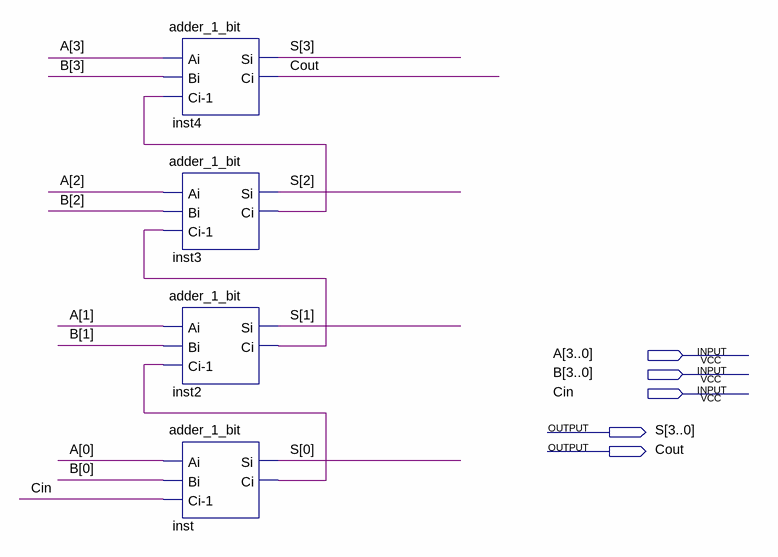
[diagram p0: schematic sheet]
// Quartus schematic adder_4_bits.bdf as structural Verilog: 4 symbols, 5 pins
module adder_4_bits (
  input  [3:0] A,
  input  [3:0] B,
  input  Cin,
  output [3:0] S,
  output Cout
);

  wire inst2_ci, inst3_ci, inst_ci;

  adder_1_bit inst4 (.Ai(A[3]), .Bi(B[3]), .\Ci-1 (inst3_ci), .Si(S[3]), .Ci(Cout));
  adder_1_bit inst3 (.Ai(A[2]), .Bi(B[2]), .\Ci-1 (inst2_ci), .Si(S[2]), .Ci(inst3_ci));
  adder_1_bit inst2 (.Ai(A[1]), .Bi(B[1]), .\Ci-1 (inst_ci), .Si(S[1]), .Ci(inst2_ci));
  adder_1_bit inst (.Ai(A[0]), .Bi(B[0]), .\Ci-1 (Cin), .Si(S[0]), .Ci(inst_ci));
endmodule
